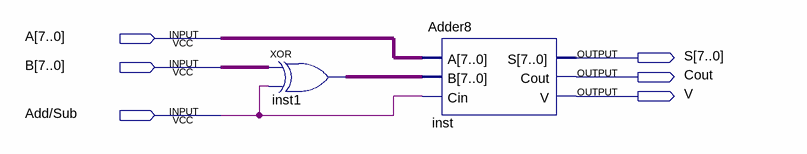
[diagram p0: schematic sheet]
// Quartus schematic AddSubUnit.bdf as structural Verilog: 2 symbols, 6 pins
module AddSubUnit (
  input  [7:0] A,
  input  [7:0] B,
  input  \Add/Sub ,
  output [7:0] S,
  output Cout,
  output V
);

  wire [7:0] inst1_out;

  assign inst1_out = B ^ {8{\Add/Sub }};  // XOR inst1, 8 bits wide
  Adder8 inst (.A(A), .B(inst1_out), .Cin(\Add/Sub ), .S(S), .Cout(Cout), .V(V));
endmodule
